# Altium schematic sheet Power Circuits.SchDoc
size A
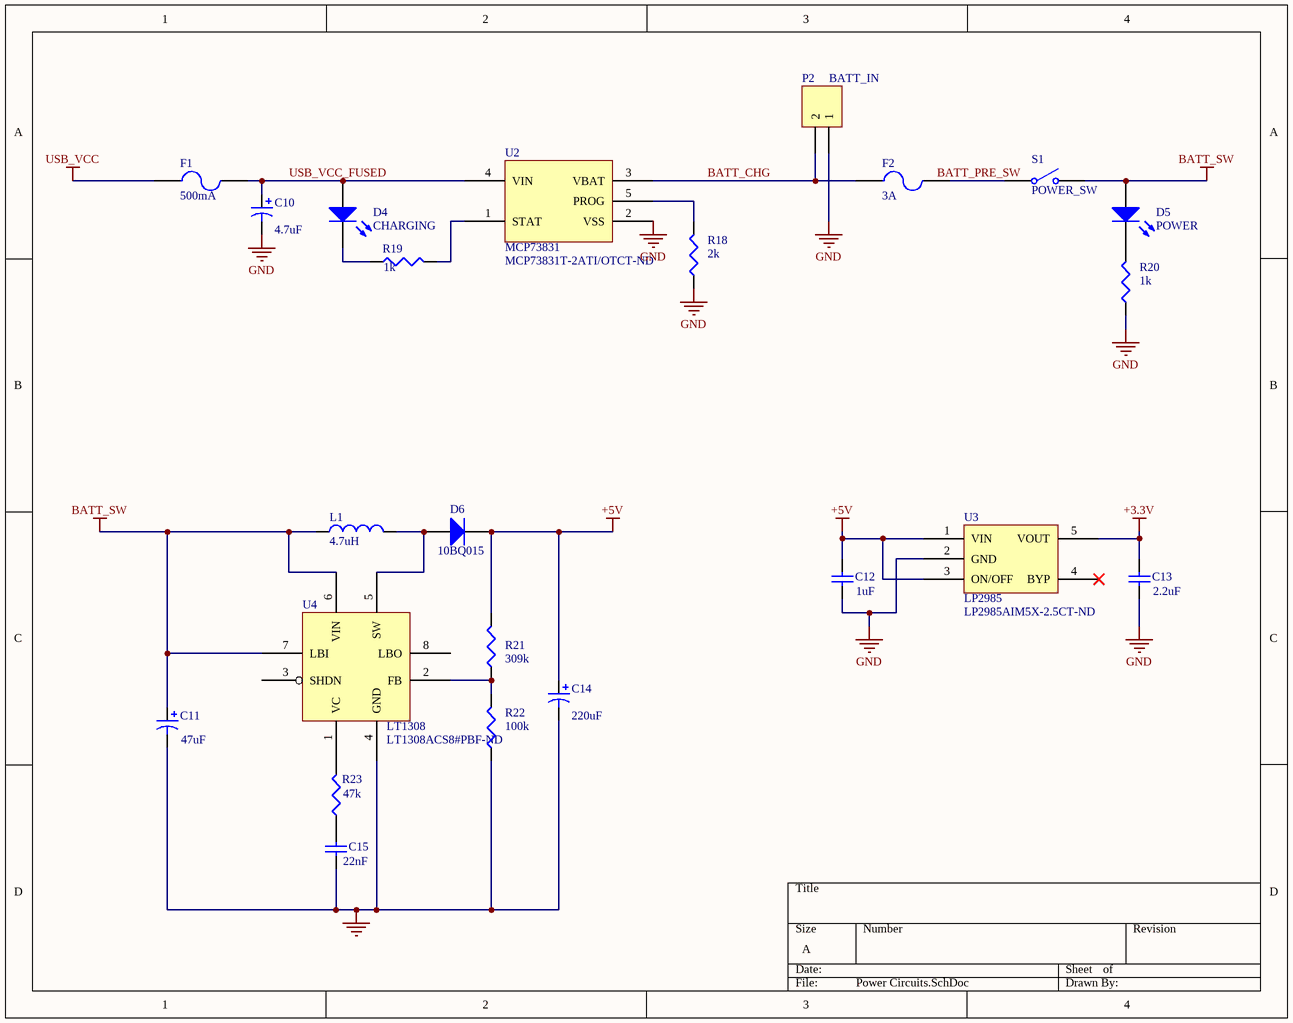
[diagram p0: Power Circuits.SchDoc]

## Parts
C10  value 4.7uF  [TC7343-2917]  (hidden comment: Cap Pol3)
C11  value 47uF  [TC6032-2412]  (hidden comment: Cap Pol3)
C12  value 1uF  [C1206]  (hidden comment: Cap Semi)
C13  value 2.2uF  [C1206]  (hidden comment: Cap Semi)
C14  value 220uF  [TC7343-2917]  (hidden comment: Cap Pol3)
C15  value 22nF  [C1206]  (hidden comment: Cap Semi)
D4  CHARGING  [HDR1X2]
D5  POWER  [HDR1X2]
D6  10BQ015  [DSO-C2/X2.3]
F1  500mA  [RESC3216M]
F2  3A  [RESC3216M]
L1  value 4.7uH  [MURATA SMT INDUCTOR]  (hidden comment: Inductor)
P2  BATT_IN  [2MM JST PH - 2 PIN VERT]
R18  value 2k  [RESC3216M]  (hidden comment: Res3)
R19  value 1k  [RESC3216M]  (hidden comment: Res3)
R20  value 1k  [RESC3216M]  (hidden comment: Res3)
R21  value 309k  [RESC3216M]  (hidden comment: Res3)
R22  value 100k  [RESC3216M]  (hidden comment: Res3)
R23  value 47k  [RESC3216M]  (hidden comment: Res3)
S1  POWER_SW  [DPDT_PUSHBUTTON_SWITCH]
U2  MCP73831  Supplier Part Number 1: MCP73831T-2ATI/OTCT-ND  [SOT23-5AM]
U3  LP2985  Supplier Part Number 1: LP2985AIM5X-2.5CT-ND  [SOT23-5AM]
U4  LT1308  Supplier Part Number 1: LT1308ACS8#PBF-ND  [SOIC127P600-8AM]

## Nets
+3.3V: C13.2 U3.5(VOUT)
+5V: C12.2 C14.1 D6.2(K) R21.2 U3.1(VIN) U3.3(ON/OFF)
BATT_SW: C11.1 D5.1(A) L1.1 S1.2(NO) U4.6(VIN) U4.7(LBI)
GND: C10.2 C11.2 C12.1 C13.1 C14.2 C15.1 P2.1 R18.1 R20.1 R22.1 U2.2(VSS) U3.2(GND) U4.4(GND)
USB_VCC: F1.1
BATT_CHG: F2.1 P2.2 U2.3(VBAT)
USB_VCC_FUSED: C10.1 D4.1(A) F1.2 U2.4(VIN)
NetC15_2: C15.2 R23.1
NetD4_2: D4.2(K) R19.1
NetD5_2: D5.2(K) R20.2
NetD6_1: D6.1(A) L1.2 U4.5(SW)
NetF2_2: F2.2 S1.1(COMMON)
NetR18_2: R18.2 U2.5(PROG)
NetR19_2: R19.2 U2.1(STAT)
NetR21_1: R21.1 R22.2 U4.2(FB)
NetR23_2: R23.2 U4.1(VC)

Not connected (* = marked no-connect by the designer): U3 4(BYP)*; U4 3(SHDN) 8(LBO)

## Notes on the sheet
- Labels drawn without touching a wire or pin: BATT_PRE_SW

## Library data of the parts
C10 C11 C14 = Cap Pol3: Polarized Capacitor (Surface Mount); Published: 8-Jun-2000; LatestRevisionDate: 29-May-2009; LatestRevisionNote: IPC-7351 Footprint Added.; PackageReference: C0805; Publisher: Altium Limited; PackageDescription: Chip Capacitor
C12 C13 C15 = Cap Semi: Capacitor (Semiconductor SIM Model); Published: 8-Jun-2000; LatestRevisionDate: 29-May-2009; LatestRevisionNote: IPC-7351 Footprint Added.; PackageReference: C1206; Publisher: Altium Limited; PackageDescription: Chip Capacitor
D4 D5 = LED3: Typical BLUE SiC LED; Published: 8-Jun-2000; LatestRevisionDate: 17-Dec-2003; LatestRevisionNote: PCB Footprint replaced.; DatasheetVersion: 16-Apr-2002; PackageVersion: 16-Apr-2002; PackageReference: 3.5X2.8X1.9; Publisher: Altium Limited; PackageDescription: SM LED; 2 C-Bend Leads; Body 3.5 x 2.8 x 1.9 mm, inc leads (LxWxH typ)
D6 = Diode: Default Diode; Published: 8-Jun-2000; LatestRevisionDate: 17-Jul-2002; LatestRevisionNote: Re-released for DXP Platform.; PackageVersion: Sep-1996; PackageReference: SMC; Publisher: Altium Limited; PackageDescription: DO-214-AB/SMC; 2 C-Bend Leads; Body 7.9 x 5.9 mm, inc. leads (LxW); Code_JEDEC: DO-214-AB
F1 F2 = Fuse 2: Fuse; Published: 8-Jun-2000; LatestRevisionDate: 17-Jul-2002; LatestRevisionNote: Re-released for DXP Platform.; PackageReference: PIN-W2/E2.8; Publisher: Altium Limited; PackageDescription: Thru-Hole; 2 Leads
L1 = Inductor: Code_IEC: 1005; Published: 8-Jun-2000; LatestRevisionDate: 29-May-2009; LatestRevisionNote: IPC-7351 Footprint Added.; PackageReference: 0402-A; Publisher: Altium Limited; PackageDescription: Chip Inductor; Code_JEITA: 0402
P2 = Header 2: Header, 2-Pin; LatestRevisionDate: 17-Jul-2002; LatestRevisionNote: Re-released for DXP Platform.; Publisher: Altium Limited
R18-R23 = Res3: Resistor; Published: 8-Jun-2000; LatestRevisionDate: 29-May-2009; LatestRevisionNote: IPC-7351 Footprint Added.; PackageReference: J1-0603; Publisher: Altium Limited; PackageDescription: Chip Resistor
S1 = SW-SPST: Single-Pole, Single-Throw Switch; pin to pad: 1>D 2>S2; Published: 24-Mar-1999; LatestRevisionDate: 17-Jul-2002; LatestRevisionNote: Re-released for DXP Platform.; PackageReference: SPST-2; Publisher: Altium Limited; PackageDescription: Switch; 2 Leads
U2 = MCP73831: Supplier 1: Digi-Key
U3 = LP2985: Supplier 1: Digi-Key
U4 = LT1308: Supplier 1: Digi-Key